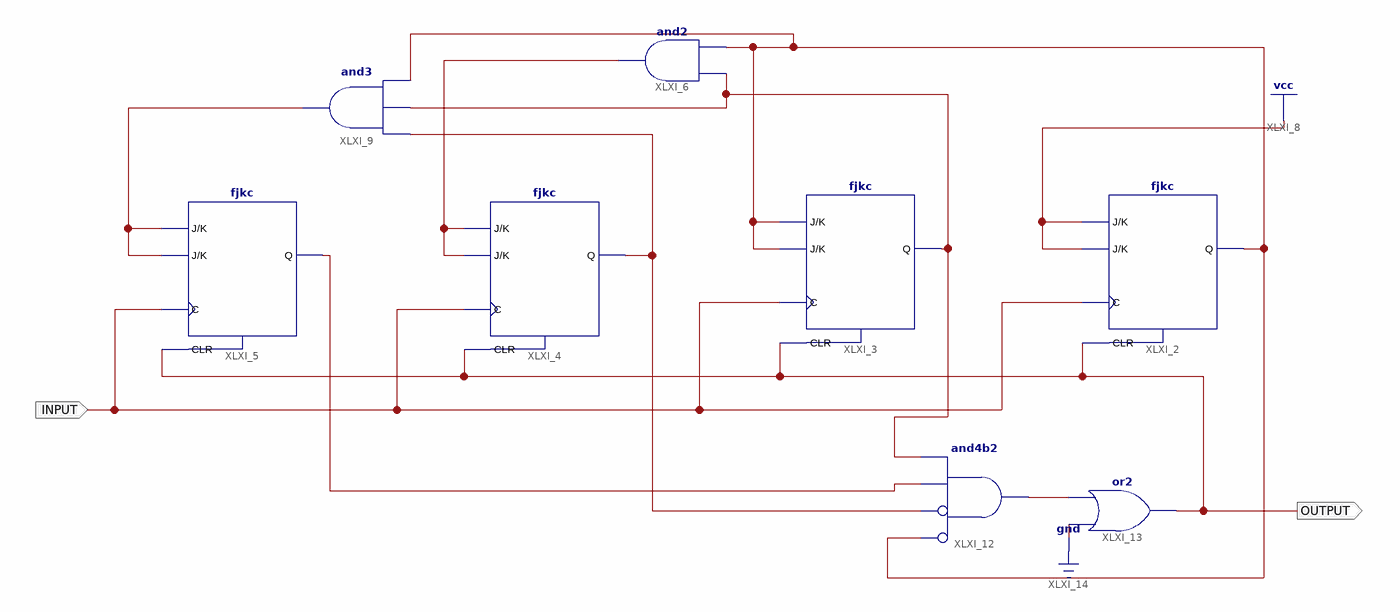
[diagram p0: schematic sheet 1]
// Xilinx ISE schematic mode10.sch (spartan6) as structural Verilog: 8 symbols, 2 ports
module mode10 (
  input  INPUT,
  output OUTPUT
);

  wire XLXN_6, XLXN_10, XLXN_12, XLXN_13, XLXN_14, XLXN_22, XLXN_30;

  fjkc XLXI_3 (.C(INPUT), .CLR(OUTPUT), .J(XLXN_13), .K(XLXN_13), .Q(XLXN_6));
  fjkc XLXI_4 (.C(INPUT), .CLR(OUTPUT), .J(XLXN_10), .K(XLXN_10), .Q(XLXN_12));
  fjkc XLXI_5 (.C(INPUT), .CLR(OUTPUT), .J(XLXN_14), .K(XLXN_14), .Q(XLXN_22));
  and XLXI_6 (XLXN_10, XLXN_6, XLXN_13);
  and XLXI_9 (XLXN_14, XLXN_12, XLXN_6, XLXN_13);
  and XLXI_12 (XLXN_30, ~XLXN_13, ~XLXN_12, XLXN_22, XLXN_6);  // and4b2
  or XLXI_13 (OUTPUT, 1'b0, XLXN_30);
  fjkc XLXI_2 (.C(INPUT), .CLR(OUTPUT), .J(1'b1), .K(1'b1), .Q(XLXN_13));
endmodule
